# Altium project calentador.PrjPcb
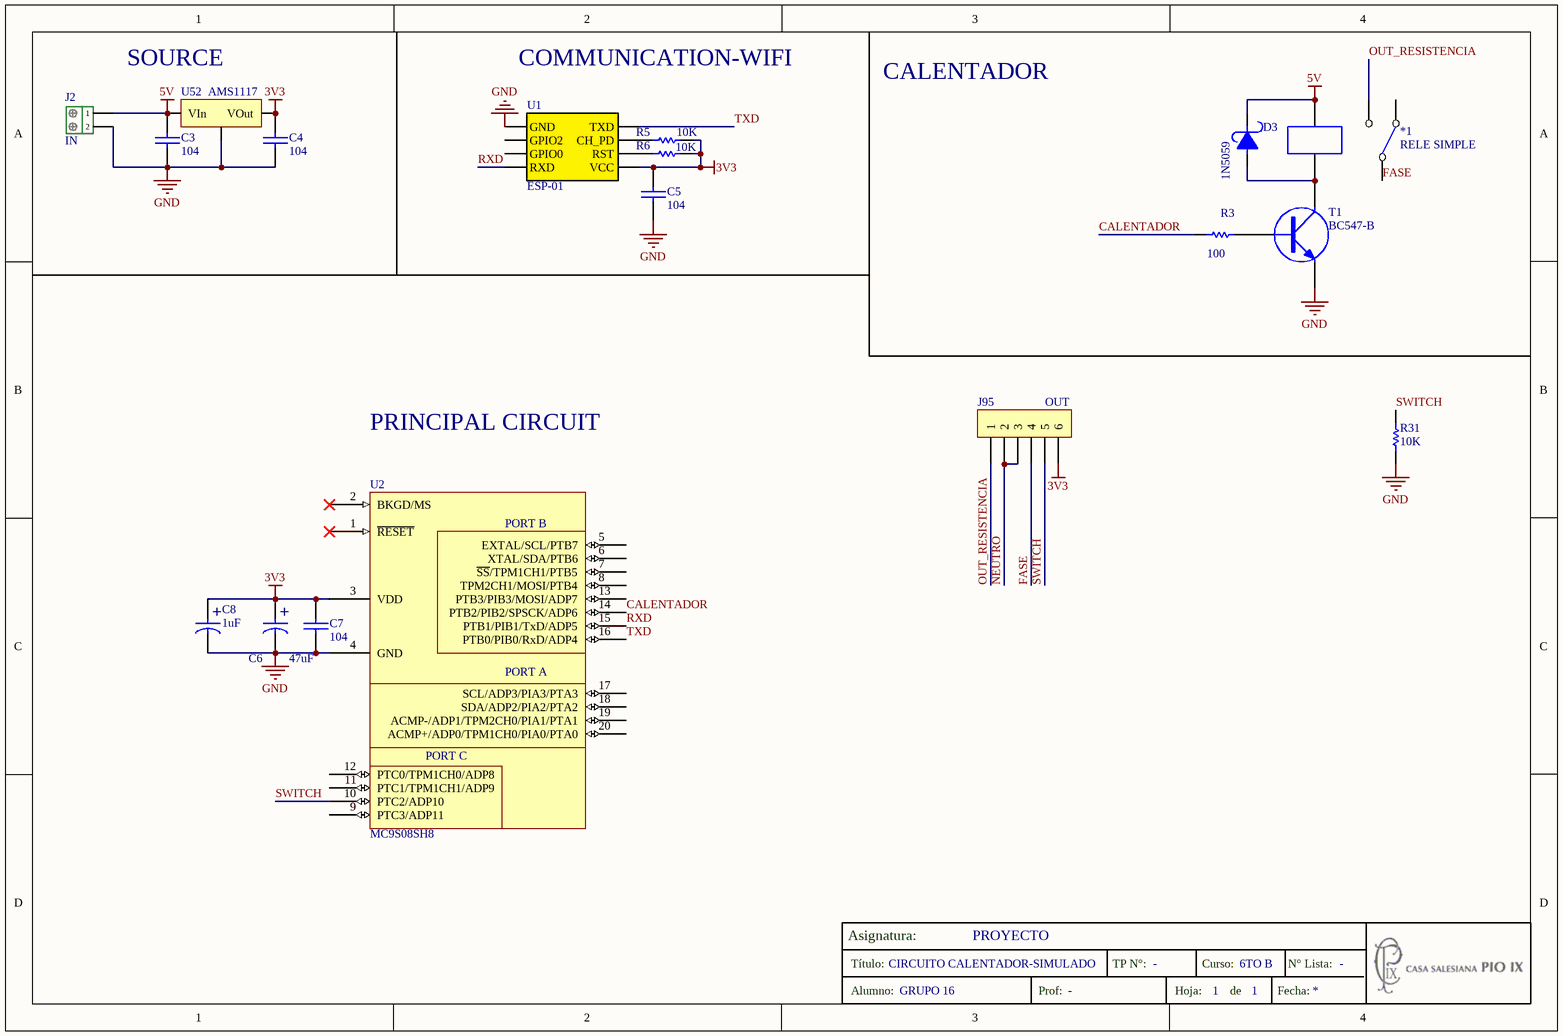
[diagram p0: esq.SchDoc]
1 sheet, 18 parts. Net scope: global (net labels, ports and power ports of the same name join across sheets).
Board file: pcb.PcbDoc

## Sheet esq.SchDoc
size A4; SheetNumber: 1; SheetTotal: 1; Titulo: CIRCUITO CALENTADOR-SIMULADO; Alumno: GRUPO 16; profesor: -; curso: 6TO B; TPN: -; NLista: -; Asignatura: PROYECTO; Año: 2020; Rule: PcbType=ProtelPcb

### Parts
*1  RELE SIMPLE  [RELE SERIE 943]
C3  104  [0805]
C4  104  [0805]
C5  104  [0805]
C6  47uF  [CAP100RP]
C7  104  [0805]
C8  1uF  [CAP100RP]
D3  1N5059  [Diodo]
J2  IN  [BORNERA2]
J95  OUT  [BORNERA6]
R3  100  [0805]
R5  10K  [0805]
R6  10K  [0805]
R31  10K  [0805]
T1  BC547-B  [SOT23]
U1  ESP-01  [ESP-01]
U2  MC9S08SH8  [SH8]
U52  AMS1117  [AMS1117]

### Nets
3V3: C4.1 C5.2 C6.1 C7.1 C8.1 J95.6 R5.1 R6.1 U1.8(VCC) U2.3(VDD) U52.3(VOut)
5V: *1.B1 C3.1 D3.2 J2.1 U52.1(VIn)
GND: C3.2 C4.2 C5.1 C6.2 C7.2 C8.2 J2.2 R31.2 T1.3(E) U1.1(GND) U2.4(GND) U52.2(GND)
CALENTADOR: R3.2 U2.14(PTB2/PIB2/SPSCK/ADP6)
FASE: *1.C1 J95.4
NEUTRO: J95.2 J95.3
OUT_RESISTENCIA: *1.NA1 J95.1
RXD: U1.4(RXD) U2.15(PTB1/PIB1/TxD/ADP5)
SWITCH: J95.5 R31.1 U2.10(PTC2/ADP10)
TXD: U1.5(TXD) U2.16(PTB0/PIB0/RxD/ADP4)
Net*1_B2: *1.B2 D3.1 T1.2(C)
NetR3_1: R3.1 T1.1(B)
NetR5_2: R5.2 U1.6(CH_PD)
NetR6_2: R6.2 U1.7(RST)

Not connected (* = marked no-connect by the designer): *1 NC1; U1 2(GPIO2) 3(GPIO0); U2 1(~{RESET})* 2(BKGD/MS)* 5(EXTAL/SCL/PTB7) 6(XTAL/SDA/PTB6) 7(~{SS}/TPM1CH1/PTB5) 8(TPM2CH1/MOSI/PTB4) 9(PTC3/ADP11) 11(PTC1/TPM1CH1/ADP9) 12(PTC0/TPM1CH0/ADP8) 13(PTB3/PIB3/MOSI/ADP7) 17(SCL/ADP3/PIA3/PTA3) 18(SDA/ADP2/PIA2/PTA2) 19(ACMP-/ADP1/TPM2CH0/PIA1/PTA1) 20(ACMP+/ADP0/TPM1CH0/PIA0/PTA0)

### Notes on the sheet
- SOURCE
- COMMUNICATION-WIFI
- CALENTADOR
- PRINCIPAL CIRCUIT
- Asignatura:
- Título:
- TP N°:
- Curso:
- N° Lista:
- Alumno:
- Prof:
- Hoja:
- de
- Fecha:
- (in symbol CAPPOL) +
- (in symbol MC9S08SH8) PORT B; PORT A; PORT C

### Library data of the parts
C3-C5 C7 = CAP: Autor: Guido Spataro; Data: Libebal; Fecha: 07/04/19
C6 C8 = CAPPOL: Cap polarizado
D3 = DIODO SCHOTTKY: Diodo; Autor: Guido Spataro; DAta: https://assets.nexperia.com/documents/outline-drawing/SOD123.pdf; Fecha: 07/04/19
J2 = Bornera_2: Bornera de 2 pines; Autor: Guido Spataro; Datasheet: Libebal; Fecha: 07/04/19
J95 = BORNERA 6
R3 R5 R6 R31 = RES: Resistencia; Autor: Guido Spataro; Data: Libebal; Fecha: 07/04/19
T1 = TRANSISTOR NPN
U2 = MC9S08SH8: Micro controlador; Autor: Guido Spataro; data: https://www.nxp.com/docs/en/data-sheet/MC9S08SH8.pdf; Fecha: 07/04/19